# Altium project as14120.PrjPCB (part 2 of 2)

## Sheet as14120_fpga_power_conf.SchDoc
size A3
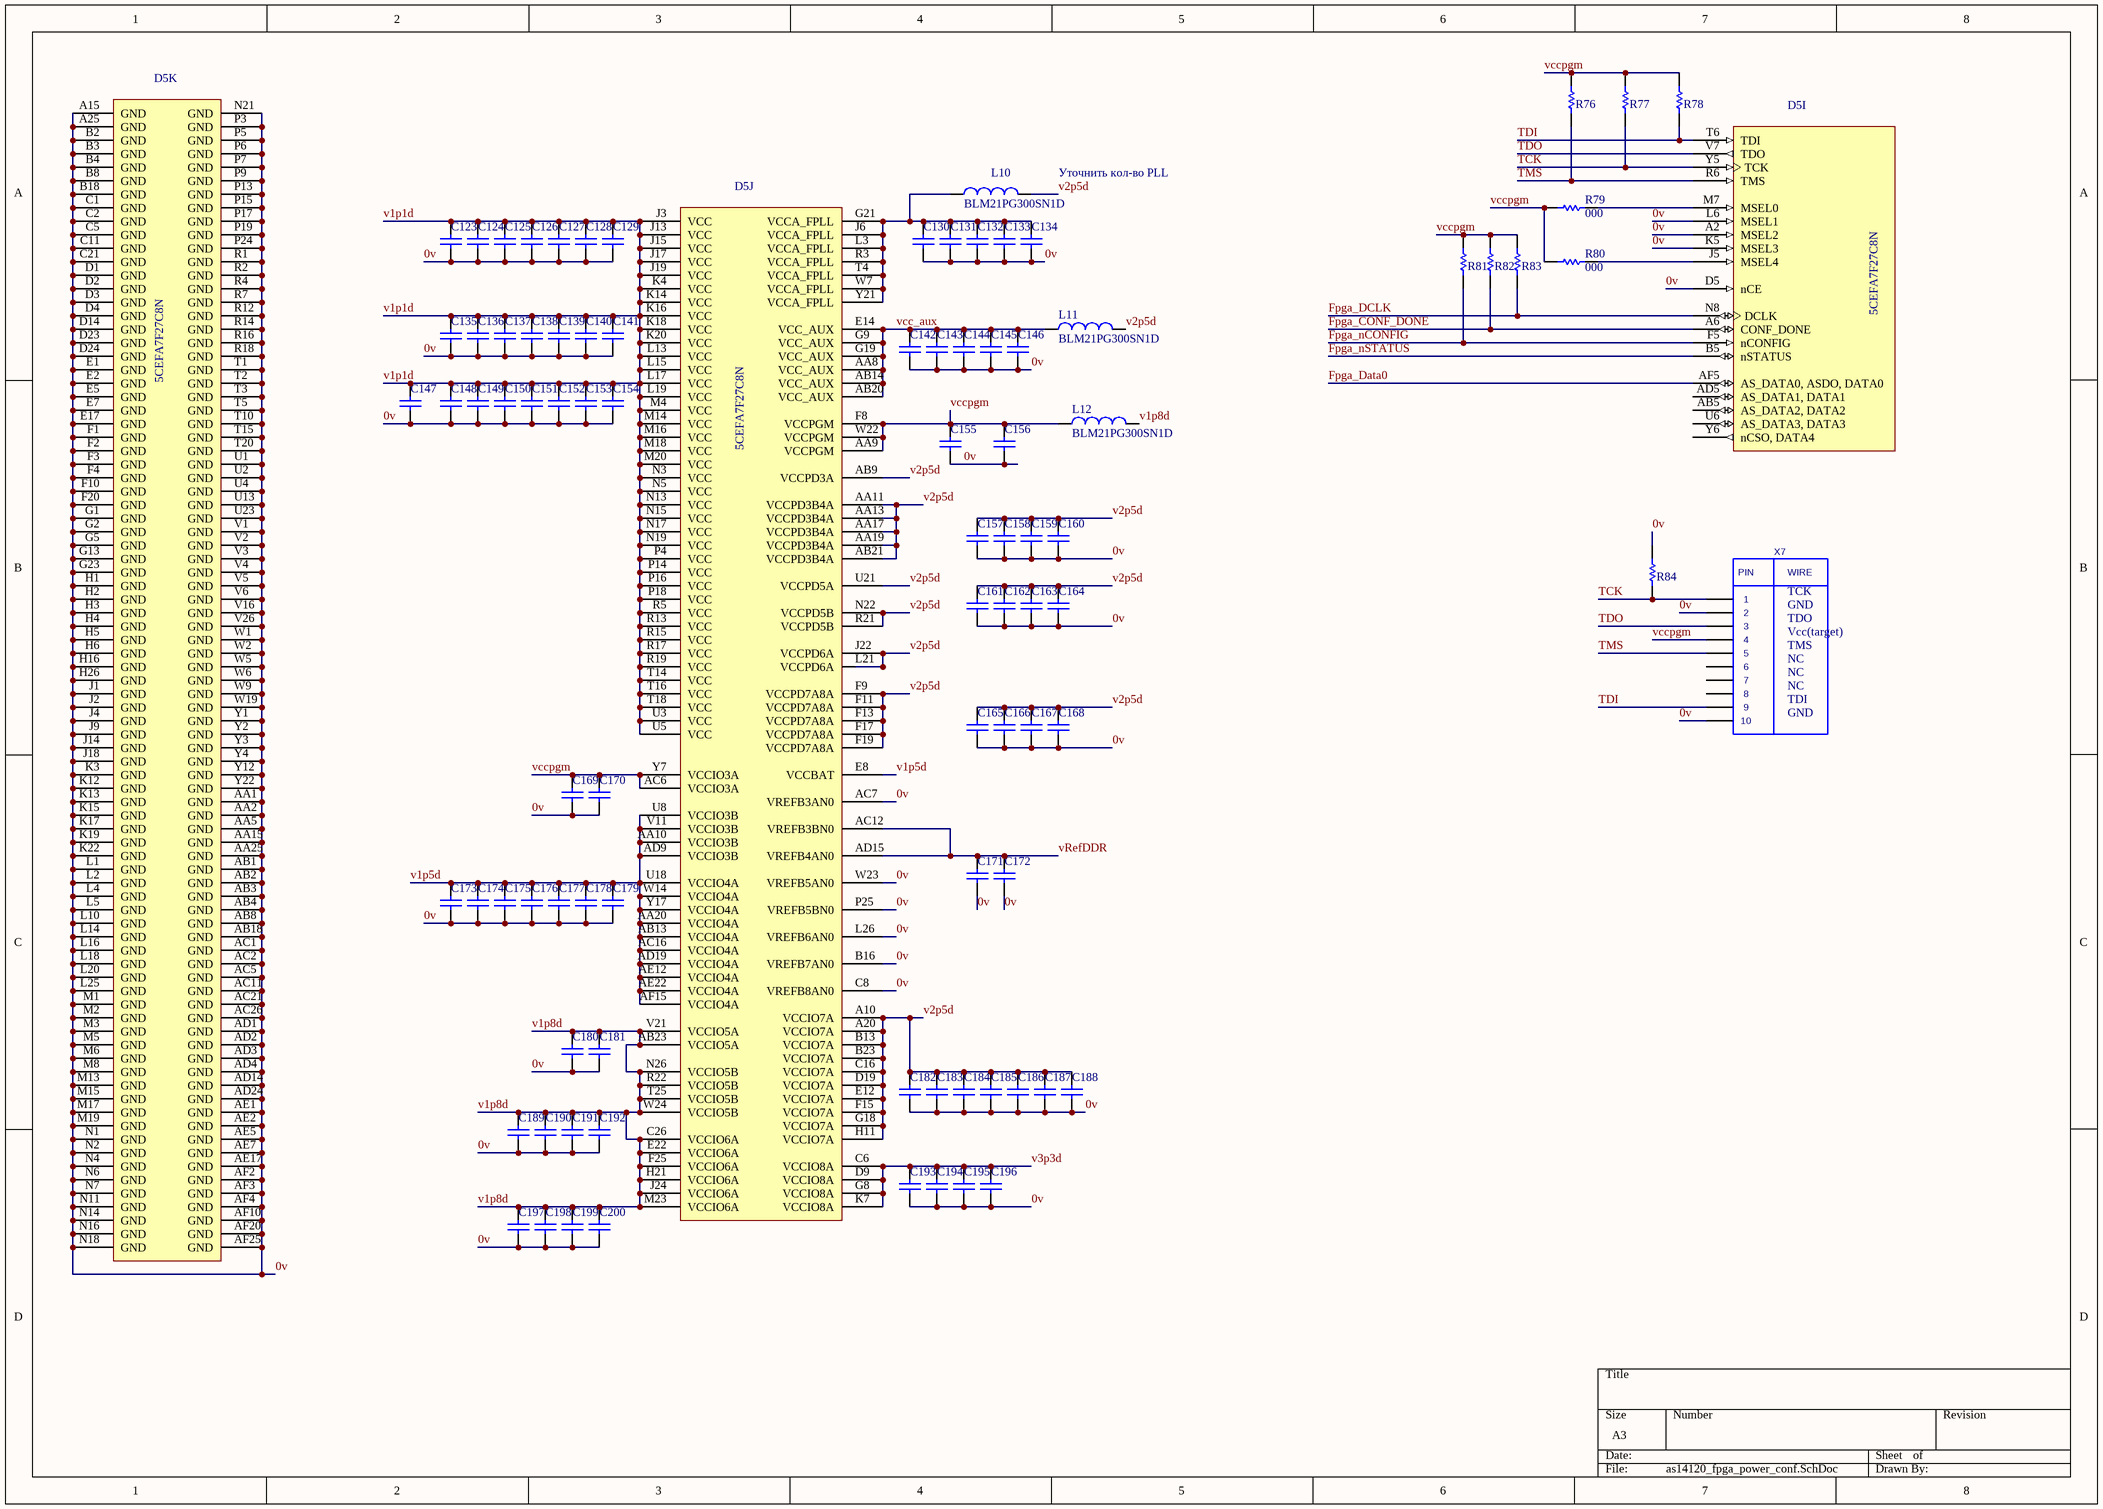
[diagram p4: as14120_fpga_power_conf.SchDoc]

### Parts
C123  CAP 1uF 10V 0402(1005)  [CAPC0402(1005)60_M]  (value not drawn)
C124  CAP 1uF 10V 0402(1005)  [CAPC0402(1005)60_M]  (value not drawn)
C125  CAP 1uF 10V 0402(1005)  [CAPC0402(1005)60_M]  (value not drawn)
C126  CAP 1uF 10V 0402(1005)  [CAPC0402(1005)60_M]  (value not drawn)
C127  CAP 1uF 10V 0402(1005)  [CAPC0402(1005)60_M]  (value not drawn)
C128  CAP 1uF 10V 0402(1005)  [CAPC0402(1005)60_M]  (value not drawn)
C129  CAP 1uF 10V 0402(1005)  [CAPC0402(1005)60_M]  (value not drawn)
C130  CAP 1uF 10V 0402(1005)  [CAPC0402(1005)60_M]  (value not drawn)
C131  CAP 1uF 10V 0402(1005)  [CAPC0402(1005)60_M]  (value not drawn)
C132  CAP 1uF 10V 0402(1005)  [CAPC0402(1005)60_M]  (value not drawn)
C133  CAP 1uF 10V 0402(1005)  [CAPC0402(1005)60_M]  (value not drawn)
C134  CAP 1uF 10V 0402(1005)  [CAPC0402(1005)60_M]  (value not drawn)
C135  CAP 1uF 10V 0402(1005)  [CAPC0402(1005)60_M]  (value not drawn)
C136  CAP 1uF 10V 0402(1005)  [CAPC0402(1005)60_M]  (value not drawn)
C137  CAP 1uF 10V 0402(1005)  [CAPC0402(1005)60_M]  (value not drawn)
C138  CAP 1uF 10V 0402(1005)  [CAPC0402(1005)60_M]  (value not drawn)
C139  CAP 1uF 10V 0402(1005)  [CAPC0402(1005)60_M]  (value not drawn)
C140  CAP 1uF 10V 0402(1005)  [CAPC0402(1005)60_M]  (value not drawn)
C141  CAP 1uF 10V 0402(1005)  [CAPC0402(1005)60_M]  (value not drawn)
C142  CAP 1uF 10V 0402(1005)  [CAPC0402(1005)60_M]  (value not drawn)
C143  CAP 1uF 10V 0402(1005)  [CAPC0402(1005)60_M]  (value not drawn)
C144  CAP 1uF 10V 0402(1005)  [CAPC0402(1005)60_M]  (value not drawn)
C145  CAP 1uF 10V 0402(1005)  [CAPC0402(1005)60_M]  (value not drawn)
C146  CAP 1uF 10V 0402(1005)  [CAPC0402(1005)60_M]  (value not drawn)
C147  CAP 1uF 10V 0402(1005)  [CAPC0402(1005)60_M]  (value not drawn)
C148  CAP 1uF 10V 0402(1005)  [CAPC0402(1005)60_M]  (value not drawn)
C149  CAP 1uF 10V 0402(1005)  [CAPC0402(1005)60_M]  (value not drawn)
C150  CAP 1uF 10V 0402(1005)  [CAPC0402(1005)60_M]  (value not drawn)
C151  CAP 1uF 10V 0402(1005)  [CAPC0402(1005)60_M]  (value not drawn)
C152  CAP 1uF 10V 0402(1005)  [CAPC0402(1005)60_M]  (value not drawn)
C153  CAP 1uF 10V 0402(1005)  [CAPC0402(1005)60_M]  (value not drawn)
C154  CAP 1uF 10V 0402(1005)  [CAPC0402(1005)60_M]  (value not drawn)
C155  CAP 1uF 10V 0402(1005)  [CAPC0402(1005)60_M]  (value not drawn)
C156  CAP 1uF 10V 0402(1005)  [CAPC0402(1005)60_M]  (value not drawn)
C157  CAP 1uF 10V 0402(1005)  [CAPC0402(1005)60_M]  (value not drawn)
C158  CAP 1uF 10V 0402(1005)  [CAPC0402(1005)60_M]  (value not drawn)
C159  CAP 1uF 10V 0402(1005)  [CAPC0402(1005)60_M]  (value not drawn)
C160  CAP 1uF 10V 0402(1005)  [CAPC0402(1005)60_M]  (value not drawn)
C161  CAP 1uF 10V 0402(1005)  [CAPC0402(1005)60_M]  (value not drawn)
C162  CAP 1uF 10V 0402(1005)  [CAPC0402(1005)60_M]  (value not drawn)
C163  CAP 1uF 10V 0402(1005)  [CAPC0402(1005)60_M]  (value not drawn)
C164  CAP 1uF 10V 0402(1005)  [CAPC0402(1005)60_M]  (value not drawn)
C165  CAP 1uF 10V 0402(1005)  [CAPC0402(1005)60_M]  (value not drawn)
C166  CAP 1uF 10V 0402(1005)  [CAPC0402(1005)60_M]  (value not drawn)
C167  CAP 1uF 10V 0402(1005)  [CAPC0402(1005)60_M]  (value not drawn)
C168  CAP 1uF 10V 0402(1005)  [CAPC0402(1005)60_M]  (value not drawn)
C169  CAP 1uF 10V 0402(1005)  [CAPC0402(1005)60_M]  (value not drawn)
C170  CAP 1uF 10V 0402(1005)  [CAPC0402(1005)60_M]  (value not drawn)
C171  CAP 1uF 10V 0402(1005)  [CAPC0402(1005)60_M]  (value not drawn)
C172  CAP 1uF 10V 0402(1005)  [CAPC0402(1005)60_M]  (value not drawn)
C173  CAP 1uF 10V 0402(1005)  [CAPC0402(1005)60_M]  (value not drawn)
C174  CAP 1uF 10V 0402(1005)  [CAPC0402(1005)60_M]  (value not drawn)
C175  CAP 1uF 10V 0402(1005)  [CAPC0402(1005)60_M]  (value not drawn)
C176  CAP 1uF 10V 0402(1005)  [CAPC0402(1005)60_M]  (value not drawn)
C177  CAP 1uF 10V 0402(1005)  [CAPC0402(1005)60_M]  (value not drawn)
C178  CAP 1uF 10V 0402(1005)  [CAPC0402(1005)60_M]  (value not drawn)
C179  CAP 1uF 10V 0402(1005)  [CAPC0402(1005)60_M]  (value not drawn)
C180  CAP 1uF 10V 0402(1005)  [CAPC0402(1005)60_M]  (value not drawn)
C181  CAP 1uF 10V 0402(1005)  [CAPC0402(1005)60_M]  (value not drawn)
C182  CAP 1uF 10V 0402(1005)  [CAPC0402(1005)60_M]  (value not drawn)
C183  CAP 1uF 10V 0402(1005)  [CAPC0402(1005)60_M]  (value not drawn)
C184  CAP 1uF 10V 0402(1005)  [CAPC0402(1005)60_M]  (value not drawn)
C185  CAP 1uF 10V 0402(1005)  [CAPC0402(1005)60_M]  (value not drawn)
C186  CAP 1uF 10V 0402(1005)  [CAPC0402(1005)60_M]  (value not drawn)
C187  CAP 1uF 10V 0402(1005)  [CAPC0402(1005)60_M]  (value not drawn)
C188  CAP 1uF 10V 0402(1005)  [CAPC0402(1005)60_M]  (value not drawn)
C189  CAP 1uF 10V 0402(1005)  [CAPC0402(1005)60_M]  (value not drawn)
C190  CAP 1uF 10V 0402(1005)  [CAPC0402(1005)60_M]  (value not drawn)
C191  CAP 1uF 10V 0402(1005)  [CAPC0402(1005)60_M]  (value not drawn)
C192  CAP 1uF 10V 0402(1005)  [CAPC0402(1005)60_M]  (value not drawn)
C193  CAP 1uF 10V 0402(1005)  [CAPC0402(1005)60_M]  (value not drawn)
C194  CAP 1uF 10V 0402(1005)  [CAPC0402(1005)60_M]  (value not drawn)
C195  CAP 1uF 10V 0402(1005)  [CAPC0402(1005)60_M]  (value not drawn)
C196  CAP 1uF 10V 0402(1005)  [CAPC0402(1005)60_M]  (value not drawn)
C197  CAP 1uF 10V 0402(1005)  [CAPC0402(1005)60_M]  (value not drawn)
C198  CAP 1uF 10V 0402(1005)  [CAPC0402(1005)60_M]  (value not drawn)
C199  CAP 1uF 10V 0402(1005)  [CAPC0402(1005)60_M]  (value not drawn)
C200  CAP 1uF 10V 0402(1005)  [CAPC0402(1005)60_M]  (value not drawn)
D5  5CEFA7F27C8N  [ALTR-672-FBGA-2000A]  (parts I,J,K of 12)
L10  BLM21PG300SN1D  [CAPC0805(2012)100_N]
L11  BLM21PG300SN1D  [CAPC0805(2012)100_N]
L12  BLM21PG300SN1D  [CAPC0805(2012)100_N]
R76  1K 5% 0603(1608)  [RESC0603(1608)_L]  (value not drawn)
R77  1K 5% 0603(1608)  [RESC0603(1608)_L]  (value not drawn)
R78  1K 5% 0603(1608)  [RESC0603(1608)_L]  (value not drawn)
R79  value 000  [RESC0603(1608)_L]  (hidden comment: 1K 5% 0603(1608))
R80  value 000  [RESC0603(1608)_L]  (hidden comment: 1K 5% 0603(1608))
R81  1K 5% 0603(1608)  [RESC0603(1608)_L]  (value not drawn)
R82  1K 5% 0603(1608)  [RESC0603(1608)_L]  (value not drawn)
R83  1K 5% 0603(1608)  [RESC0603(1608)_L]  (value not drawn)
R84  1K 5% 0603(1608)  [RESC0603(1608)_L]  (value not drawn)
X7  IDC10  [IDC10M]  (value not drawn)

### Nets
0v: C123.1 C124.1 C125.1 C126.1 C127.1 C128.1 C129.1 C130.1 C131.1 C132.1 C133.1 C134.1 C135.1 C136.1 C137.1 C138.1 C139.1 C140.1 C141.1 C142.1 C143.1 C144.1 C145.1 C146.1 C147.1 C148.1 C149.1 C150.1 C151.1 C152.1 C153.1 C154.1 C155.1 C156.1 C157.1 C158.1 C159.1 C160.1 C161.1 C162.1 C163.1 C164.1 C165.1 C166.1 C167.1 C168.1 C169.1 C170.1 C171.1 C172.1 C173.1 C174.1 C175.1 C176.1 C177.1 C178.1 C179.1 C180.1 C181.1 C182.1 C183.1 C184.1 C185.1 C186.1 C187.1 C188.1 C189.1 C190.1 C191.1 C192.1 C193.1 C194.1 C195.1 C196.1 C197.1 C198.1 C199.1 C200.1 D5.A2(MSEL2) D5.A15(GND) D5.A25(GND) D5.AA1(GND) D5.AA2(GND) D5.AA5(GND) D5.AA15(GND) D5.AA25(GND) D5.AB1(GND) D5.AB2(GND) D5.AB3(GND) D5.AB4(GND) D5.AB8(GND) D5.AB18(GND) D5.AC1(GND) D5.AC2(GND) D5.AC5(GND) D5.AC7(VREFB3AN0) D5.AC11(GND) D5.AC21(GND) D5.AC26(GND) D5.AD1(GND) D5.AD2(GND) D5.AD3(GND) D5.AD4(GND) D5.AD14(GND) D5.AD24(GND) D5.AE1(GND) D5.AE2(GND) D5.AE5(GND) D5.AE7(GND) D5.AE17(GND) D5.AF2(GND) D5.AF3(GND) D5.AF4(GND) D5.AF10(GND) D5.AF20(GND) D5.AF25(GND) D5.B2(GND) D5.B3(GND) D5.B4(GND) D5.B8(GND) D5.B16(VREFB7AN0) D5.B18(GND) D5.C1(GND) D5.C2(GND) D5.C5(GND) D5.C8(VREFB8AN0) D5.C11(GND) D5.C21(GND) D5.D1(GND) D5.D2(GND) D5.D3(GND) D5.D4(GND) D5.D5(nCE) D5.D14(GND) D5.D23(GND) D5.D24(GND) D5.E1(GND) D5.E2(GND) D5.E5(GND) D5.E7(GND) D5.E17(GND) D5.F1(GND) D5.F2(GND) D5.F3(GND) D5.F4(GND) D5.F10(GND) D5.F20(GND) D5.G1(GND) D5.G2(GND) D5.G5(GND) D5.G13(GND) D5.G23(GND) D5.H1(GND) D5.H2(GND) D5.H3(GND) D5.H4(GND) D5.H5(GND) D5.H6(GND) D5.H16(GND) D5.H26(GND) D5.J1(GND) D5.J2(GND) D5.J4(GND) D5.J9(GND) D5.J14(GND) D5.J18(GND) D5.K3(GND) D5.K5(MSEL3) D5.K12(GND) D5.K13(GND) D5.K15(GND) D5.K17(GND) D5.K19(GND) D5.K22(GND) D5.L1(GND) D5.L2(GND) D5.L4(GND) D5.L5(GND) D5.L6(MSEL1) D5.L10(GND) D5.L14(GND) D5.L16(GND) D5.L18(GND) D5.L20(GND) D5.L25(GND) D5.L26(VREFB6AN0) D5.M1(GND) D5.M2(GND) D5.M3(GND) D5.M5(GND) D5.M6(GND) D5.M8(GND) D5.M13(GND) D5.M15(GND) D5.M17(GND) D5.M19(GND) D5.N1(GND) D5.N2(GND) D5.N4(GND) D5.N6(GND) D5.N7(GND) D5.N11(GND) D5.N14(GND) D5.N16(GND) D5.N18(GND) D5.N21(GND) D5.P3(GND) D5.P5(GND) D5.P6(GND) D5.P7(GND) D5.P9(GND) D5.P13(GND) D5.P15(GND) D5.P17(GND) D5.P19(GND) D5.P24(GND) D5.P25(VREFB5BN0) D5.R1(GND) D5.R2(GND) D5.R4(GND) D5.R7(GND) D5.R12(GND) D5.R14(GND) D5.R16(GND) D5.R18(GND) D5.T1(GND) D5.T2(GND) D5.T3(GND) D5.T5(GND) D5.T10(GND) D5.T15(GND) D5.T20(GND) D5.U1(GND) D5.U2(GND) D5.U4(GND) D5.U13(GND) D5.U23(GND) D5.V1(GND) D5.V2(GND) D5.V3(GND) D5.V4(GND) D5.V5(GND) D5.V6(GND) D5.V16(GND) D5.V26(GND) D5.W1(GND) D5.W2(GND) D5.W5(GND) D5.W6(GND) D5.W9(GND) D5.W19(GND) D5.W23(VREFB5AN0) D5.Y1(GND) D5.Y2(GND) D5.Y3(GND) D5.Y4(GND) D5.Y12(GND) D5.Y22(GND) R84.1 X7.2 X7.10
Fpga_CONF_DONE: D5.A6(CONF_DONE) R82.2
Fpga_Data0: D5.AF5(AS_DATA0,_ASDO,_DATA0)
Fpga_DCLK: D5.N8(DCLK) R83.2
Fpga_nCONFIG: D5.F5(nCONFIG) R81.2
Fpga_nSTATUS: D5.B5(nSTATUS)
TCK: D5.Y5(TCK) R77.2 R84.2 X7.1
TDI: D5.T6(TDI) R78.1 X7.9
TDO: D5.V7(TDO) X7.3
TMS: D5.R6(TMS) R76.2 X7.5
v1p1d: C123.2 C124.2 C125.2 C126.2 C127.2 C128.2 C129.2 C135.2 C136.2 C137.2 C138.2 C139.2 C140.2 C141.2 C147.2 C148.2 C149.2 C150.2 C151.2 C152.2 C153.2 C154.2 D5.J3(VCC) D5.J13(VCC) D5.J15(VCC) D5.J17(VCC) D5.J19(VCC) D5.K4(VCC) D5.K14(VCC) D5.K16(VCC) D5.K18(VCC) D5.K20(VCC) D5.L13(VCC) D5.L15(VCC) D5.L17(VCC) D5.L19(VCC) D5.M4(VCC) D5.M14(VCC) D5.M16(VCC) D5.M18(VCC) D5.M20(VCC) D5.N3(VCC) D5.N5(VCC) D5.N13(VCC) D5.N15(VCC) D5.N17(VCC) D5.N19(VCC) D5.P4(VCC) D5.P14(VCC) D5.P16(VCC) D5.P18(VCC) D5.R5(VCC) D5.R13(VCC) D5.R15(VCC) D5.R17(VCC) D5.R19(VCC) D5.T14(VCC) D5.T16(VCC) D5.T18(VCC) D5.U3(VCC) D5.U5(VCC)
v1p5d: C173.2 C174.2 C175.2 C176.2 C177.2 C178.2 C179.2 D5.AA10(VCCIO3B) D5.AA20(VCCIO4A) D5.AB13(VCCIO4A) D5.AC16(VCCIO4A) D5.AD9(VCCIO3B) D5.AD19(VCCIO4A) D5.AE12(VCCIO4A) D5.AE22(VCCIO4A) D5.AF15(VCCIO4A) D5.E8(VCCBAT) D5.U8(VCCIO3B) D5.U18(VCCIO4A) D5.V11(VCCIO3B) D5.W14(VCCIO4A) D5.Y17(VCCIO4A)
v1p8d: C180.2 C181.2 C189.2 C190.2 C191.2 C192.2 C197.2 C198.2 C199.2 C200.2 D5.AB23(VCCIO5A) D5.C26(VCCIO6A) D5.E22(VCCIO6A) D5.F25(VCCIO6A) D5.H21(VCCIO6A) D5.J24(VCCIO6A) D5.M23(VCCIO6A) D5.N26(VCCIO5B) D5.R22(VCCIO5B) D5.T25(VCCIO5B) D5.V21(VCCIO5A) D5.W24(VCCIO5B) L12.2
v2p5d: C157.2 C158.2 C159.2 C160.2 C161.2 C162.2 C163.2 C164.2 C165.2 C166.2 C167.2 C168.2 C182.2 C183.2 C184.2 C185.2 C186.2 C187.2 C188.2 D5.A10(VCCIO7A) D5.A20(VCCIO7A) D5.AA11(VCCPD3B4A) D5.AA13(VCCPD3B4A) D5.AA17(VCCPD3B4A) D5.AA19(VCCPD3B4A) D5.AB9(VCCPD3A) D5.AB21(VCCPD3B4A) D5.B13(VCCIO7A) D5.B23(VCCIO7A) D5.C16(VCCIO7A) D5.D19(VCCIO7A) D5.E12(VCCIO7A) D5.F9(VCCPD7A8A) D5.F11(VCCPD7A8A) D5.F13(VCCPD7A8A) D5.F15(VCCIO7A) D5.F17(VCCPD7A8A) D5.F19(VCCPD7A8A) D5.G18(VCCIO7A) D5.H11(VCCIO7A) D5.J22(VCCPD6A) D5.L21(VCCPD6A) D5.N22(VCCPD5B) D5.R21(VCCPD5B) D5.U21(VCCPD5A) L10.2 L11.2
v3p3d: C193.2 C194.2 C195.2 C196.2 D5.C6(VCCIO8A) D5.D9(VCCIO8A) D5.G8(VCCIO8A) D5.K7(VCCIO8A)
vcc_aux: C142.2 C143.2 C144.2 C145.2 C146.2 D5.AA8(VCC_AUX) D5.AB14(VCC_AUX) D5.AB20(VCC_AUX) D5.E14(VCC_AUX) D5.G9(VCC_AUX) D5.G19(VCC_AUX) L11.1
vccpgm: C155.2 C156.2 C169.2 C170.2 D5.AA9(VCCPGM) D5.AC6(VCCIO3A) D5.F8(VCCPGM) D5.W22(VCCPGM) D5.Y7(VCCIO3A) L12.1 R76.1 R77.1 R78.2 R79.2 R80.2 R81.1 R82.1 R83.1 X7.4
vRefDDR: C171.2 C172.2 D5.AC12(VREFB3BN0) D5.AD15(VREFB4AN0)
NetC130_2: C130.2 C131.2 C132.2 C133.2 C134.2 D5.G21(VCCA_FPLL) D5.J6(VCCA_FPLL) D5.L3(VCCA_FPLL) D5.R3(VCCA_FPLL) D5.T4(VCCA_FPLL) D5.W7(VCCA_FPLL) D5.Y21(VCCA_FPLL) L10.1
NetD5_J5: D5.J5(MSEL4) R80.1
NetD5_M7: D5.M7(MSEL0) R79.1

Not connected (* = marked no-connect by the designer): D5 AB5(AS_DATA2,_DATA2) AD5(AS_DATA1,_DATA1) U6(AS_DATA3,_DATA3) Y6(nCSO,_DATA4); X7 6 7 8

### Notes on the sheet
- Уточнить кол-во PLL
- TCK
- GND
- TDO
- Vcc(target)
- TMS
- NC
- TDI
- (in symbol IDC10) PIN; WIRE

### Library data of the parts
C123-C200 = CAP_0402: CAP 1uF 10V ±20% 0402 (1005 Metric) Thickness 0.6mm SMD; Case-Metric: 1005; Case-EIA: 0402; Value: 0.1; Tolerance: ±20%; Max Thickness: 0.6 mm; Rated Voltage: 10 V; Technology: SMT
D5 = 5CEFA7F27C8N: as D5 on sheet as14120_fpga_ttl; DatasheetVersion: Rev. 3.1; PackageReference: 672-FBGA-2000A; PackageDescription: 672-Pin FineLine Ball-Grid Array (FBGA), Body 27 x 27 mm, Pitch 1 mm; Supplier 1: Digi-Key; Supplier Part Number 1: 5CEFA7F27C8N-ND; Supplier 2: Mouser; Supplier Part Number 2: 989-5CEFA7F27C8N; RoHS: RoHS Compliant; Subcategory: Cyclone V E; Voltage Supply: 1.07 to 1.13 V; Mounting Technology: Surface Mount; Code_JEDEC: MS-034-AAL-1; PartNumber: 5CEFA7F27C8N; ComponentLink1Description: Manufacturer URL; ComponentLink1URL: http://www.altera.com; ComponentLink2Description: Datasheet; ComponentLink2URL: http://www.altera.com/literature/hb/cyclone-v/cv_51002.pdf; ComponentLink3Description: Package Specification; ComponentLink3URL: http://www.altera.com/devicepackaging/04R00427-01.pdf; ComponentLink4Description: Device Handbook URL; ComponentLink4URL: http://www.altera.com/literature/hb/cyclone-v/cyclone5_handbook.pdf; ComponentLink5Description: Device Overview URL; ComponentLink5URL: http://www.altera.com/literature/hb/cyclone-v/cv_51001.pdf; ComponentLink6Description: Device Pin-Out URL; ComponentLink6URL: http://www.altera.com/literature/dp/cyclone-v/1.1.txt; ComponentLink7Description: Product URL; ComponentLink7URL: http://www.buyaltera.com/scripts/partsearch.dll?Detail&name=5CEFA7F27C8N-ND
L10-L12 = Ferrite_beat
R76-R78 R81-R83 = RES_0603: 1K 0.1W 5% 0603 (1608 Metric)  SMD; Case-EIA: 0603; Case-Metric: 1608; Value: 10k; Technology: SMT; Tolerance: 5 %; Power: 0.1 W
R79 R80 R84 = RES_0603: as R3 on sheet as14120_usb; Technology: SMT; Tolerance: 5 %; Power: 0.1 W
  R84: Value: 1k
X7 = IDC10: Value: *

## Sheet as14120_fpga_cypress.SchDoc
size A3
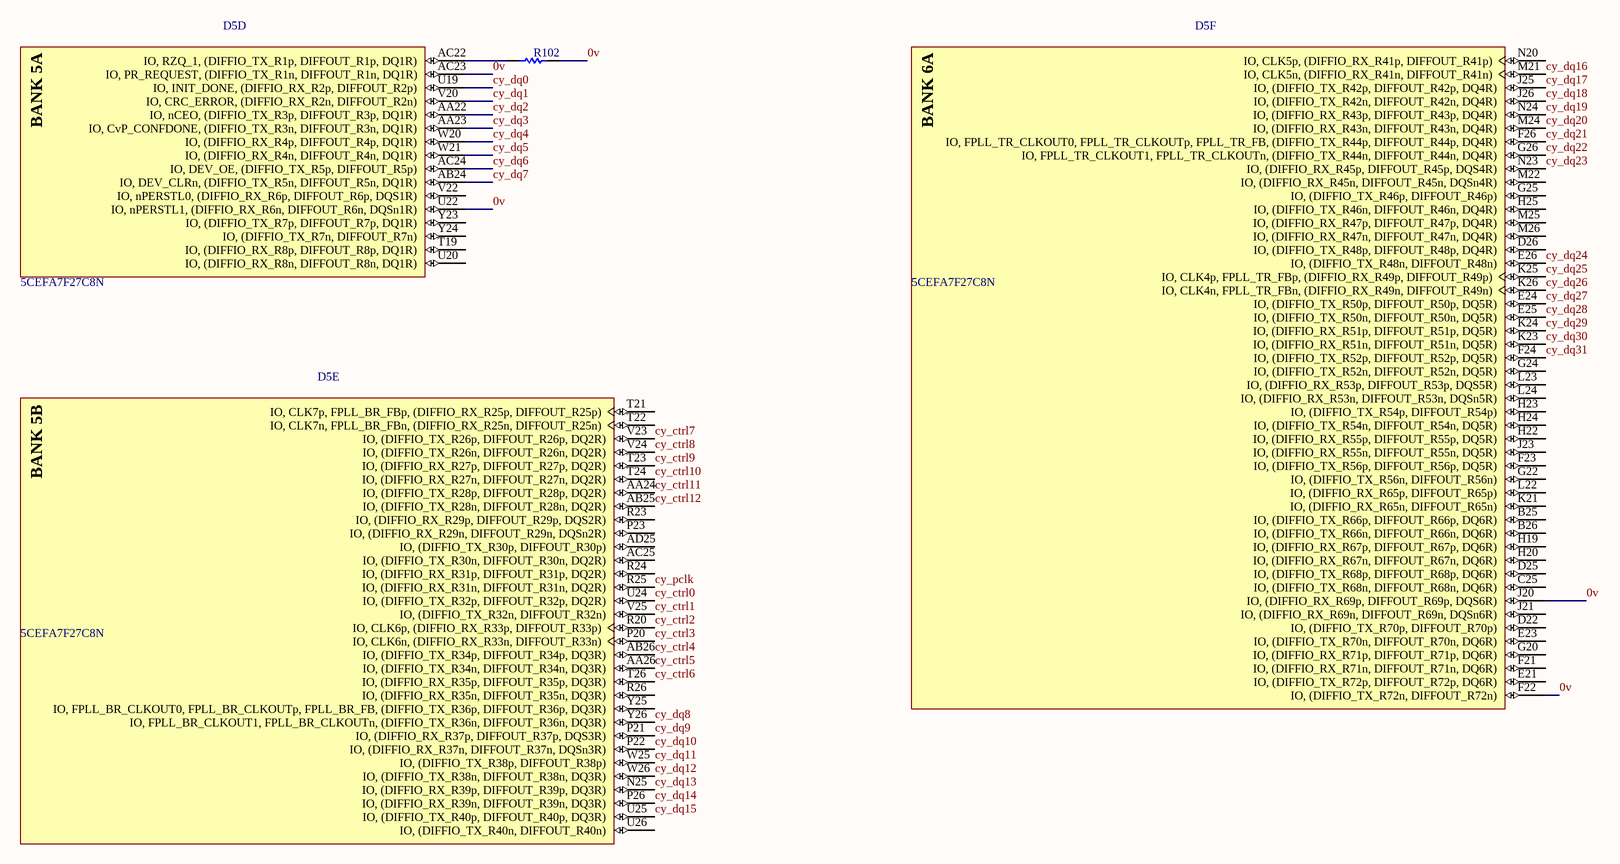
[diagram p5: as14120_fpga_cypress.SchDoc]

### Parts
D5  5CEFA7F27C8N  [ALTR-672-FBGA-2000A]  (parts D,E,F of 12)
R102  ???  [RESC0603(1608)_L]  (value not drawn)

### Nets
0v: D5.AC23(IO,_PR_REQUEST,_(DIFFIO_TX_R1n,_DIFFOUT_R1n,_DQ1R)) D5.F22(IO,_(DIFFIO_TX_R72n,_DIFFOUT_R72n)) D5.J20(IO,_(DIFFIO_RX_R69p,_DIFFOUT_R69p,_DQS6R)) D5.U22(IO,_nPERSTL1,_(DIFFIO_RX_R6n,_DIFFOUT_R6n,_DQSn1R)) R102.2
cy_ctrl0: D5.U24(IO,_(DIFFIO_TX_R32p,_DIFFOUT_R32p,_DQ2R))
cy_ctrl1: D5.V25(IO,_(DIFFIO_TX_R32n,_DIFFOUT_R32n))
cy_ctrl2: D5.R20(IO,_CLK6p,_(DIFFIO_RX_R33p,_DIFFOUT_R33p))
cy_ctrl3: D5.P20(IO,_CLK6n,_(DIFFIO_RX_R33n,_DIFFOUT_R33n))
cy_ctrl4: D5.AB26(IO,_(DIFFIO_TX_R34p,_DIFFOUT_R34p,_DQ3R))
cy_ctrl5: D5.AA26(IO,_(DIFFIO_TX_R34n,_DIFFOUT_R34n,_DQ3R))
cy_ctrl6: D5.T26(IO,_(DIFFIO_RX_R35p,_DIFFOUT_R35p,_DQ3R))
cy_ctrl7: D5.V23(IO,_(DIFFIO_TX_R26p,_DIFFOUT_R26p,_DQ2R))
cy_ctrl8: D5.V24(IO,_(DIFFIO_TX_R26n,_DIFFOUT_R26n,_DQ2R))
cy_ctrl9: D5.T23(IO,_(DIFFIO_RX_R27p,_DIFFOUT_R27p,_DQ2R))
cy_ctrl10: D5.T24(IO,_(DIFFIO_RX_R27n,_DIFFOUT_R27n,_DQ2R))
cy_ctrl11: D5.AA24(IO,_(DIFFIO_TX_R28p,_DIFFOUT_R28p,_DQ2R))
cy_ctrl12: D5.AB25(IO,_(DIFFIO_TX_R28n,_DIFFOUT_R28n,_DQ2R))
cy_dq0: D5.U19(IO,_INIT_DONE,_(DIFFIO_RX_R2p,_DIFFOUT_R2p))
cy_dq1: D5.V20(IO,_CRC_ERROR,_(DIFFIO_RX_R2n,_DIFFOUT_R2n))
cy_dq2: D5.AA22(IO,_nCEO,_(DIFFIO_TX_R3p,_DIFFOUT_R3p,_DQ1R))
cy_dq3: D5.AA23(IO,_CvP_CONFDONE,_(DIFFIO_TX_R3n,_DIFFOUT_R3n,_DQ1R))
cy_dq4: D5.W20(IO,_(DIFFIO_RX_R4p,_DIFFOUT_R4p,_DQ1R))
cy_dq5: D5.W21(IO,_(DIFFIO_RX_R4n,_DIFFOUT_R4n,_DQ1R))
cy_dq6: D5.AC24(IO,_DEV_OE,_(DIFFIO_TX_R5p,_DIFFOUT_R5p))
cy_dq7: D5.AB24(IO,_DEV_CLRn,_(DIFFIO_TX_R5n,_DIFFOUT_R5n,_DQ1R))
cy_dq8: D5.Y26(IO,_FPLL_BR_CLKOUT1,_FPLL_BR_CLKOUTn,_(DIFFIO_TX_R36n,_DIFFOUT_R36n,_DQ3R))
cy_dq9: D5.P21(IO,_(DIFFIO_RX_R37p,_DIFFOUT_R37p,_DQS3R))
cy_dq10: D5.P22(IO,_(DIFFIO_RX_R37n,_DIFFOUT_R37n,_DQSn3R))
cy_dq11: D5.W25(IO,_(DIFFIO_TX_R38p,_DIFFOUT_R38p))
cy_dq12: D5.W26(IO,_(DIFFIO_TX_R38n,_DIFFOUT_R38n,_DQ3R))
cy_dq13: D5.N25(IO,_(DIFFIO_RX_R39p,_DIFFOUT_R39p,_DQ3R))
cy_dq14: D5.P26(IO,_(DIFFIO_RX_R39n,_DIFFOUT_R39n,_DQ3R))
cy_dq15: D5.U25(IO,_(DIFFIO_TX_R40p,_DIFFOUT_R40p,_DQ3R))
cy_dq16: D5.M21(IO,_CLK5n,_(DIFFIO_RX_R41n,_DIFFOUT_R41n))
cy_dq17: D5.J25(IO,_(DIFFIO_TX_R42p,_DIFFOUT_R42p,_DQ4R))
cy_dq18: D5.J26(IO,_(DIFFIO_TX_R42n,_DIFFOUT_R42n,_DQ4R))
cy_dq19: D5.N24(IO,_(DIFFIO_RX_R43p,_DIFFOUT_R43p,_DQ4R))
cy_dq20: D5.M24(IO,_(DIFFIO_RX_R43n,_DIFFOUT_R43n,_DQ4R))
cy_dq21: D5.F26(IO,_FPLL_TR_CLKOUT0,_FPLL_TR_CLKOUTp,_FPLL_TR_FB,_(DIFFIO_TX_R44p,_DIFFOUT_R44p,_DQ4R))
cy_dq22: D5.G26(IO,_FPLL_TR_CLKOUT1,_FPLL_TR_CLKOUTn,_(DIFFIO_TX_R44n,_DIFFOUT_R44n,_DQ4R))
cy_dq23: D5.N23(IO,_(DIFFIO_RX_R45p,_DIFFOUT_R45p,_DQS4R))
cy_dq24: D5.E26(IO,_(DIFFIO_TX_R48n,_DIFFOUT_R48n))
cy_dq25: D5.K25(IO,_CLK4p,_FPLL_TR_FBp,_(DIFFIO_RX_R49p,_DIFFOUT_R49p))
cy_dq26: D5.K26(IO,_CLK4n,_FPLL_TR_FBn,_(DIFFIO_RX_R49n,_DIFFOUT_R49n))
cy_dq27: D5.E24(IO,_(DIFFIO_TX_R50p,_DIFFOUT_R50p,_DQ5R))
cy_dq28: D5.E25(IO,_(DIFFIO_TX_R50n,_DIFFOUT_R50n,_DQ5R))
cy_dq29: D5.K24(IO,_(DIFFIO_RX_R51p,_DIFFOUT_R51p,_DQ5R))
cy_dq30: D5.K23(IO,_(DIFFIO_RX_R51n,_DIFFOUT_R51n,_DQ5R))
cy_dq31: D5.F24(IO,_(DIFFIO_TX_R52p,_DIFFOUT_R52p,_DQ5R))
cy_pclk: D5.R25(IO,_(DIFFIO_RX_R31n,_DIFFOUT_R31n,_DQ2R))
NetD5_AC22: D5.AC22(IO,_RZQ_1,_(DIFFIO_TX_R1p,_DIFFOUT_R1p,_DQ1R)) R102.1

Not connected (* = marked no-connect by the designer): D5 AC25(IO,_(DIFFIO_TX_R30n,_DIFFOUT_R30n,_DQ2R)) AD25(IO,_(DIFFIO_TX_R30p,_DIFFOUT_R30p)) B25(IO,_(DIFFIO_TX_R66p,_DIFFOUT_R66p,_DQ6R)) B26(IO,_(DIFFIO_TX_R66n,_DIFFOUT_R66n,_DQ6R)) C25(IO,_(DIFFIO_TX_R68n,_DIFFOUT_R68n,_DQ6R)) D22(IO,_(DIFFIO_TX_R70p,_DIFFOUT_R70p)) D25(IO,_(DIFFIO_TX_R68p,_DIFFOUT_R68p,_DQ6R)) D26(IO,_(DIFFIO_TX_R48p,_DIFFOUT_R48p,_DQ4R)) E21(IO,_(DIFFIO_TX_R72p,_DIFFOUT_R72p,_DQ6R)) E23(IO,_(DIFFIO_TX_R70n,_DIFFOUT_R70n,_DQ6R)) F21(IO,_(DIFFIO_RX_R71n,_DIFFOUT_R71n,_DQ6R)) F23(IO,_(DIFFIO_TX_R56p,_DIFFOUT_R56p,_DQ5R)) G20(IO,_(DIFFIO_RX_R71p,_DIFFOUT_R71p,_DQ6R)) G22(IO,_(DIFFIO_TX_R56n,_DIFFOUT_R56n)) G24(IO,_(DIFFIO_TX_R52n,_DIFFOUT_R52n,_DQ5R)) G25(IO,_(DIFFIO_TX_R46p,_DIFFOUT_R46p)) H19(IO,_(DIFFIO_RX_R67p,_DIFFOUT_R67p,_DQ6R)) H20(IO,_(DIFFIO_RX_R67n,_DIFFOUT_R67n,_DQ6R)) H22(IO,_(DIFFIO_RX_R55p,_DIFFOUT_R55p,_DQ5R)) H23(IO,_(DIFFIO_TX_R54p,_DIFFOUT_R54p)) H24(IO,_(DIFFIO_TX_R54n,_DIFFOUT_R54n,_DQ5R)) H25(IO,_(DIFFIO_TX_R46n,_DIFFOUT_R46n,_DQ4R)) J21(IO,_(DIFFIO_RX_R69n,_DIFFOUT_R69n,_DQSn6R)) J23(IO,_(DIFFIO_RX_R55n,_DIFFOUT_R55n,_DQ5R)) K21(IO,_(DIFFIO_RX_R65n,_DIFFOUT_R65n)) L22(IO,_(DIFFIO_RX_R65p,_DIFFOUT_R65p)) L23(IO,_(DIFFIO_RX_R53p,_DIFFOUT_R53p,_DQS5R)) L24(IO,_(DIFFIO_RX_R53n,_DIFFOUT_R53n,_DQSn5R)) M22(IO,_(DIFFIO_RX_R45n,_DIFFOUT_R45n,_DQSn4R)) M25(IO,_(DIFFIO_RX_R47p,_DIFFOUT_R47p,_DQ4R)) M26(IO,_(DIFFIO_RX_R47n,_DIFFOUT_R47n,_DQ4R)) N20(IO,_CLK5p,_(DIFFIO_RX_R41p,_DIFFOUT_R41p)) P23(IO,_(DIFFIO_RX_R29n,_DIFFOUT_R29n,_DQSn2R)) R23(IO,_(DIFFIO_RX_R29p,_DIFFOUT_R29p,_DQS2R)) R24(IO,_(DIFFIO_RX_R31p,_DIFFOUT_R31p,_DQ2R)) R26(IO,_(DIFFIO_RX_R35n,_DIFFOUT_R35n,_DQ3R)) T19(IO,_(DIFFIO_RX_R8p,_DIFFOUT_R8p,_DQ1R)) T21(IO,_CLK7p,_FPLL_BR_FBp,_(DIFFIO_RX_R25p,_DIFFOUT_R25p)) T22(IO,_CLK7n,_FPLL_BR_FBn,_(DIFFIO_RX_R25n,_DIFFOUT_R25n)) U20(IO,_(DIFFIO_RX_R8n,_DIFFOUT_R8n,_DQ1R)) U26(IO,_(DIFFIO_TX_R40n,_DIFFOUT_R40n)) V22(IO,_nPERSTL0,_(DIFFIO_RX_R6p,_DIFFOUT_R6p,_DQS1R)) Y23(IO,_(DIFFIO_TX_R7p,_DIFFOUT_R7p,_DQ1R)) Y24(IO,_(DIFFIO_TX_R7n,_DIFFOUT_R7n)) Y25(IO,_FPLL_BR_CLKOUT0,_FPLL_BR_CLKOUTp,_FPLL_BR_FB,_(DIFFIO_TX_R36p,_DIFFOUT_R36p,_DQ3R))

### Notes on the sheet
- Title
- Size:
- Date:
- A3
- Number:
- Time:
- Revision:
- Sheet
- of
- File:
- (in symbol 5CEFA7F27C8N, part D) BANK 5A
- (in symbol 5CEFA7F27C8N, part E) BANK 5B
- (in symbol 5CEFA7F27C8N, part F) BANK 6A

### Library data of the parts
D5 = 5CEFA7F27C8N: Cyclone V E Family FPGA, 1.07 to 1.13 V Supply, 336 I/O Pins, 7 PLLs, 672-Pin FBGA, Speed Grade 8, Commercial Grade, RoHS Compliant; Manufacturer: Altera; Device Group: 5CEFA7; GPIO: 336; Logic Elements (LE) (K): 149.5; Speed Grade: 8; DatasheetVersion: Rev. 3.1; PackageReference: 672-FBGA-2000A; PackageDescription: 672-Pin FineLine Ball-Grid Array (FBGA), Body 27 x 27 mm, Pitch 1 mm; Supplier 1: Digi-Key; Supplier Part Number 1: 5CEFA7F27C8N-ND; Supplier 2: Mouser; Supplier Part Number 2: 989-5CEFA7F27C8N; RoHS: RoHS Compliant; Subcategory: Cyclone V E; Voltage Supply: 1.07 to 1.13 V; Mounting Technology: Surface Mount; Code_JEDEC: MS-034-AAL-1; PartNumber: 5CEFA7F27C8N; ComponentLink1Description: Manufacturer URL; ComponentLink1URL: http://www.altera.com; ComponentLink2Description: Datasheet; ComponentLink2URL: http://www.altera.com/literature/hb/cyclone-v/cv_51002.pdf; ComponentLink3Description: Package Specification; ComponentLink3URL: http://www.altera.com/devicepackaging/04R00427-01.pdf; ComponentLink4Description: Device Handbook URL; ComponentLink4URL: http://www.altera.com/literature/hb/cyclone-v/cyclone5_handbook.pdf; ComponentLink5Description: Device Overview URL; ComponentLink5URL: http://www.altera.com/literature/hb/cyclone-v/cv_51001.pdf; ComponentLink6Description: Device Pin-Out URL; ComponentLink6URL: http://www.altera.com/literature/dp/cyclone-v/1.1.txt; ComponentLink7Description: Product URL; ComponentLink7URL: http://www.buyaltera.com/scripts/partsearch.dll?Detail&name=5CEFA7F27C8N-ND
R102 = RES_0603: 1K 0.1W 5% 0603 (1608 Metric)  SMD; Case-EIA: 0603; Case-Metric: 1608; Technology: SMT; Value: ???; Tolerance: 5 %; Power: 0.1 W

## Sheet as14120_fpga_adc.SchDoc
size A3
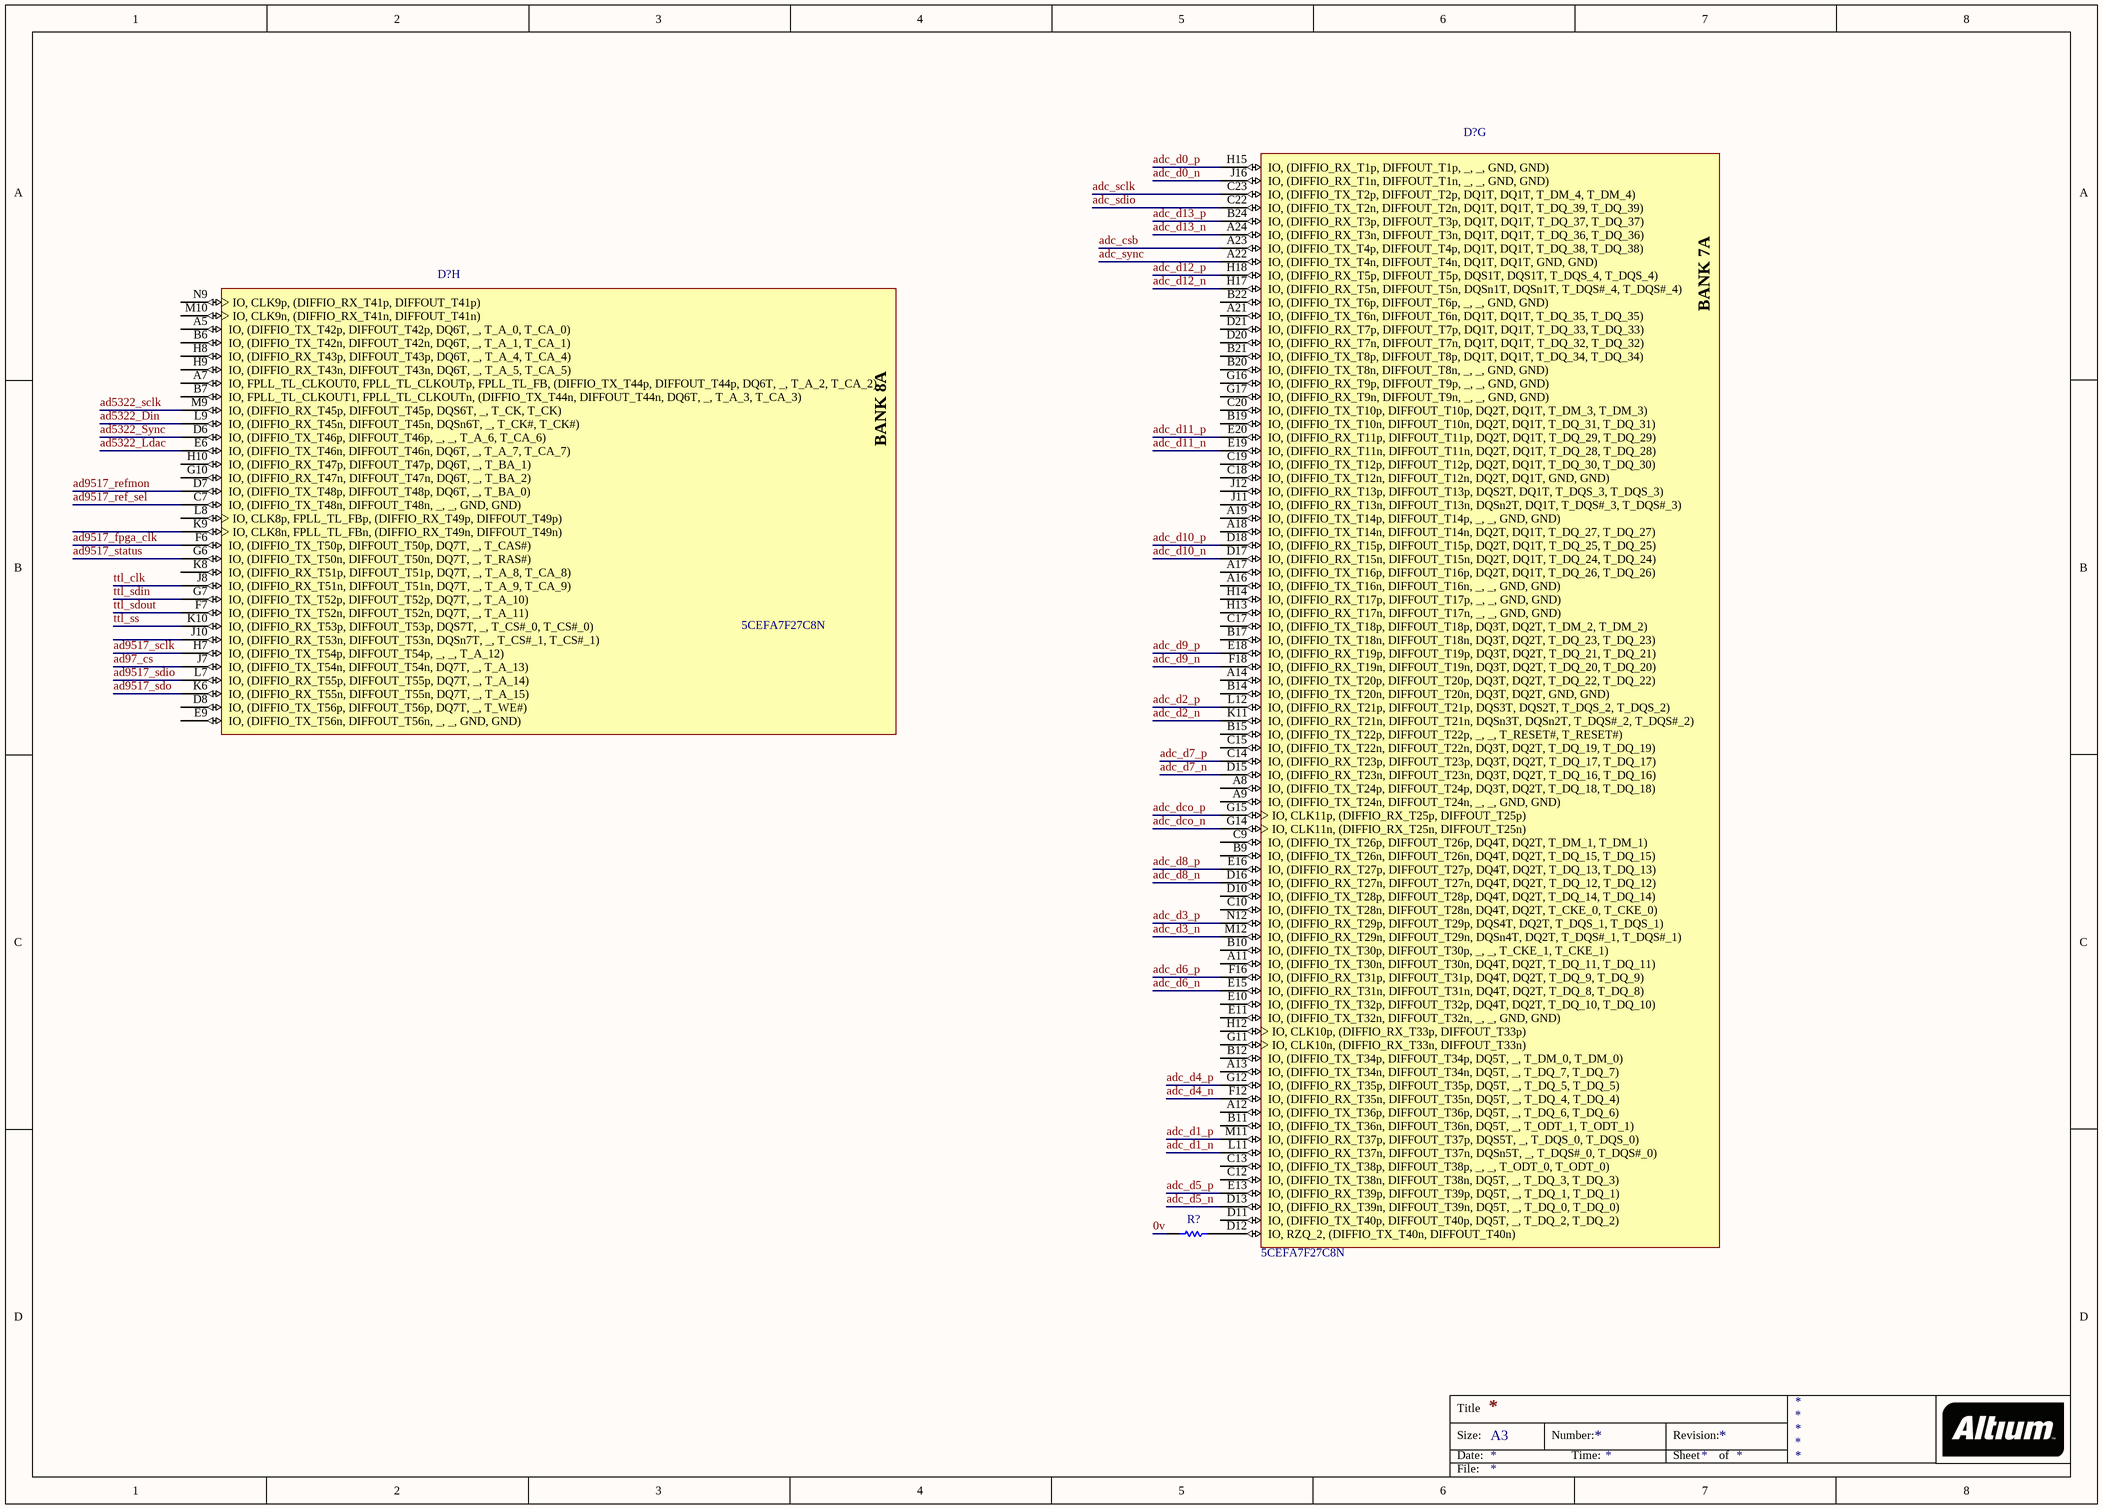
[diagram p6: as14120_fpga_adc.SchDoc]

### Parts
(Parts that share a designator on the sheet are numbered #1, #2 ... from top to bottom, then left to right.)
D?#1  5CEFA7F27C8N  [ALTR-672-FBGA-2000A]  (part G of 12)
D?#2  5CEFA7F27C8N  [ALTR-672-FBGA-2000A]  (part H of 12)
R?  ???  [RESC0603(1608)_L]  (value not drawn)

### Nets
0v: R?.1
ad97_cs: D?#2.J7(IO,_(DIFFIO_TX_T54n,_DIFFOUT_T54n,_DQ7T,__,_T_A_13))
ad5322_Din: D?#2.L9(IO,_(DIFFIO_RX_T45n,_DIFFOUT_T45n,_DQSn6T,__,_T_CK#,_T_CK#))
ad5322_Ldac: D?#2.E6(IO,_(DIFFIO_TX_T46n,_DIFFOUT_T46n,_DQ6T,__,_T_A_7,_T_CA_7))
ad5322_sclk: D?#2.M9(IO,_(DIFFIO_RX_T45p,_DIFFOUT_T45p,_DQS6T,__,_T_CK,_T_CK))
ad5322_Sync: D?#2.D6(IO,_(DIFFIO_TX_T46p,_DIFFOUT_T46p,__,__,_T_A_6,_T_CA_6))
ad9517_fpga_clk: D?#2.F6(IO,_(DIFFIO_TX_T50p,_DIFFOUT_T50p,_DQ7T,__,_T_CAS#))
ad9517_ref_sel: D?#2.C7(IO,_(DIFFIO_TX_T48n,_DIFFOUT_T48n,__,__,_GND,_GND))
ad9517_refmon: D?#2.D7(IO,_(DIFFIO_TX_T48p,_DIFFOUT_T48p,_DQ6T,__,_T_BA_0))
ad9517_sclk: D?#2.H7(IO,_(DIFFIO_TX_T54p,_DIFFOUT_T54p,__,__,_T_A_12))
ad9517_sdio: D?#2.L7(IO,_(DIFFIO_RX_T55p,_DIFFOUT_T55p,_DQ7T,__,_T_A_14))
ad9517_sdo: D?#2.K6(IO,_(DIFFIO_RX_T55n,_DIFFOUT_T55n,_DQ7T,__,_T_A_15))
ad9517_status: D?#2.G6(IO,_(DIFFIO_TX_T50n,_DIFFOUT_T50n,_DQ7T,__,_T_RAS#))
adc_csb: D?#1.A23(IO,_(DIFFIO_TX_T4p,_DIFFOUT_T4p,_DQ1T,_DQ1T,_T_DQ_38,_T_DQ_38))
adc_d0_n: D?#1.J16(IO,_(DIFFIO_RX_T1n,_DIFFOUT_T1n,__,__,_GND,_GND))
adc_d0_p: D?#1.H15(IO,_(DIFFIO_RX_T1p,_DIFFOUT_T1p,__,__,_GND,_GND))
adc_d1_n: D?#1.L11(IO,_(DIFFIO_RX_T37n,_DIFFOUT_T37n,_DQSn5T,__,_T_DQS#_0,_T_DQS#_0))
adc_d1_p: D?#1.M11(IO,_(DIFFIO_RX_T37p,_DIFFOUT_T37p,_DQS5T,__,_T_DQS_0,_T_DQS_0))
adc_d2_n: D?#1.K11(IO,_(DIFFIO_RX_T21n,_DIFFOUT_T21n,_DQSn3T,_DQSn2T,_T_DQS#_2,_T_DQS#_2))
adc_d2_p: D?#1.L12(IO,_(DIFFIO_RX_T21p,_DIFFOUT_T21p,_DQS3T,_DQS2T,_T_DQS_2,_T_DQS_2))
adc_d3_n: D?#1.M12(IO,_(DIFFIO_RX_T29n,_DIFFOUT_T29n,_DQSn4T,_DQ2T,_T_DQS#_1,_T_DQS#_1))
adc_d3_p: D?#1.N12(IO,_(DIFFIO_RX_T29p,_DIFFOUT_T29p,_DQS4T,_DQ2T,_T_DQS_1,_T_DQS_1))
adc_d4_n: D?#1.F12(IO,_(DIFFIO_RX_T35n,_DIFFOUT_T35n,_DQ5T,__,_T_DQ_4,_T_DQ_4))
adc_d4_p: D?#1.G12(IO,_(DIFFIO_RX_T35p,_DIFFOUT_T35p,_DQ5T,__,_T_DQ_5,_T_DQ_5))
adc_d5_n: D?#1.D13(IO,_(DIFFIO_RX_T39n,_DIFFOUT_T39n,_DQ5T,__,_T_DQ_0,_T_DQ_0))
adc_d5_p: D?#1.E13(IO,_(DIFFIO_RX_T39p,_DIFFOUT_T39p,_DQ5T,__,_T_DQ_1,_T_DQ_1))
adc_d6_n: D?#1.E15(IO,_(DIFFIO_RX_T31n,_DIFFOUT_T31n,_DQ4T,_DQ2T,_T_DQ_8,_T_DQ_8))
adc_d6_p: D?#1.F16(IO,_(DIFFIO_RX_T31p,_DIFFOUT_T31p,_DQ4T,_DQ2T,_T_DQ_9,_T_DQ_9))
adc_d7_n: D?#1.D15(IO,_(DIFFIO_RX_T23n,_DIFFOUT_T23n,_DQ3T,_DQ2T,_T_DQ_16,_T_DQ_16))
adc_d7_p: D?#1.C14(IO,_(DIFFIO_RX_T23p,_DIFFOUT_T23p,_DQ3T,_DQ2T,_T_DQ_17,_T_DQ_17))
adc_d8_n: D?#1.D16(IO,_(DIFFIO_RX_T27n,_DIFFOUT_T27n,_DQ4T,_DQ2T,_T_DQ_12,_T_DQ_12))
adc_d8_p: D?#1.E16(IO,_(DIFFIO_RX_T27p,_DIFFOUT_T27p,_DQ4T,_DQ2T,_T_DQ_13,_T_DQ_13))
adc_d9_n: D?#1.F18(IO,_(DIFFIO_RX_T19n,_DIFFOUT_T19n,_DQ3T,_DQ2T,_T_DQ_20,_T_DQ_20))
adc_d9_p: D?#1.E18(IO,_(DIFFIO_RX_T19p,_DIFFOUT_T19p,_DQ3T,_DQ2T,_T_DQ_21,_T_DQ_21))
adc_d10_n: D?#1.D17(IO,_(DIFFIO_RX_T15n,_DIFFOUT_T15n,_DQ2T,_DQ1T,_T_DQ_24,_T_DQ_24))
adc_d10_p: D?#1.D18(IO,_(DIFFIO_RX_T15p,_DIFFOUT_T15p,_DQ2T,_DQ1T,_T_DQ_25,_T_DQ_25))
adc_d11_n: D?#1.E19(IO,_(DIFFIO_RX_T11n,_DIFFOUT_T11n,_DQ2T,_DQ1T,_T_DQ_28,_T_DQ_28))
adc_d11_p: D?#1.E20(IO,_(DIFFIO_RX_T11p,_DIFFOUT_T11p,_DQ2T,_DQ1T,_T_DQ_29,_T_DQ_29))
adc_d12_n: D?#1.H17(IO,_(DIFFIO_RX_T5n,_DIFFOUT_T5n,_DQSn1T,_DQSn1T,_T_DQS#_4,_T_DQS#_4))
adc_d12_p: D?#1.H18(IO,_(DIFFIO_RX_T5p,_DIFFOUT_T5p,_DQS1T,_DQS1T,_T_DQS_4,_T_DQS_4))
adc_d13_n: D?#1.A24(IO,_(DIFFIO_RX_T3n,_DIFFOUT_T3n,_DQ1T,_DQ1T,_T_DQ_36,_T_DQ_36))
adc_d13_p: D?#1.B24(IO,_(DIFFIO_RX_T3p,_DIFFOUT_T3p,_DQ1T,_DQ1T,_T_DQ_37,_T_DQ_37))
adc_dco_n: D?#1.G14(IO,_CLK11n,_(DIFFIO_RX_T25n,_DIFFOUT_T25n))
adc_dco_p: D?#1.G15(IO,_CLK11p,_(DIFFIO_RX_T25p,_DIFFOUT_T25p))
adc_sclk: D?#1.C23(IO,_(DIFFIO_TX_T2p,_DIFFOUT_T2p,_DQ1T,_DQ1T,_T_DM_4,_T_DM_4))
adc_sdio: D?#1.C22(IO,_(DIFFIO_TX_T2n,_DIFFOUT_T2n,_DQ1T,_DQ1T,_T_DQ_39,_T_DQ_39))
adc_sync: D?#1.A22(IO,_(DIFFIO_TX_T4n,_DIFFOUT_T4n,_DQ1T,_DQ1T,_GND,_GND))
ttl_clk: D?#2.J8(IO,_(DIFFIO_RX_T51n,_DIFFOUT_T51n,_DQ7T,__,_T_A_9,_T_CA_9))
ttl_sdin: D?#2.G7(IO,_(DIFFIO_TX_T52p,_DIFFOUT_T52p,_DQ7T,__,_T_A_10))
ttl_sdout: D?#2.F7(IO,_(DIFFIO_TX_T52n,_DIFFOUT_T52n,_DQ7T,__,_T_A_11))
ttl_ss: D?#2.K10(IO,_(DIFFIO_RX_T53p,_DIFFOUT_T53p,_DQS7T,__,_T_CS#_0,_T_CS#_0))
NetD?#1_D12: D?#1.D12(IO,_RZQ_2,_(DIFFIO_TX_T40n,_DIFFOUT_T40n)) R?.2

Not connected (* = marked no-connect by the designer): D?#1 A8(IO,_(DIFFIO_TX_T24p,_DIFFOUT_T24p,_DQ3T,_DQ2T,_T_DQ_18,_T_DQ_18)) A9(IO,_(DIFFIO_TX_T24n,_DIFFOUT_T24n,__,__,_GND,_GND)) A11(IO,_(DIFFIO_TX_T30n,_DIFFOUT_T30n,_DQ4T,_DQ2T,_T_DQ_11,_T_DQ_11)) A12(IO,_(DIFFIO_TX_T36p,_DIFFOUT_T36p,_DQ5T,__,_T_DQ_6,_T_DQ_6)) A13(IO,_(DIFFIO_TX_T34n,_DIFFOUT_T34n,_DQ5T,__,_T_DQ_7,_T_DQ_7)) A14(IO,_(DIFFIO_TX_T20p,_DIFFOUT_T20p,_DQ3T,_DQ2T,_T_DQ_22,_T_DQ_22)) A16(IO,_(DIFFIO_TX_T16n,_DIFFOUT_T16n,__,__,_GND,_GND)) A17(IO,_(DIFFIO_TX_T16p,_DIFFOUT_T16p,_DQ2T,_DQ1T,_T_DQ_26,_T_DQ_26)) A18(IO,_(DIFFIO_TX_T14n,_DIFFOUT_T14n,_DQ2T,_DQ1T,_T_DQ_27,_T_DQ_27)) A19(IO,_(DIFFIO_TX_T14p,_DIFFOUT_T14p,__,__,_GND,_GND)) A21(IO,_(DIFFIO_TX_T6n,_DIFFOUT_T6n,_DQ1T,_DQ1T,_T_DQ_35,_T_DQ_35)) B9(IO,_(DIFFIO_TX_T26n,_DIFFOUT_T26n,_DQ4T,_DQ2T,_T_DQ_15,_T_DQ_15)) B10(IO,_(DIFFIO_TX_T30p,_DIFFOUT_T30p,__,__,_T_CKE_1,_T_CKE_1)) B11(IO,_(DIFFIO_TX_T36n,_DIFFOUT_T36n,_DQ5T,__,_T_ODT_1,_T_ODT_1)) B12(IO,_(DIFFIO_TX_T34p,_DIFFOUT_T34p,_DQ5T,__,_T_DM_0,_T_DM_0)) B14(IO,_(DIFFIO_TX_T20n,_DIFFOUT_T20n,_DQ3T,_DQ2T,_GND,_GND)) B15(IO,_(DIFFIO_TX_T22p,_DIFFOUT_T22p,__,__,_T_RESET#,_T_RESET#)) B17(IO,_(DIFFIO_TX_T18n,_DIFFOUT_T18n,_DQ3T,_DQ2T,_T_DQ_23,_T_DQ_23)) B19(IO,_(DIFFIO_TX_T10n,_DIFFOUT_T10n,_DQ2T,_DQ1T,_T_DQ_31,_T_DQ_31)) B20(IO,_(DIFFIO_TX_T8n,_DIFFOUT_T8n,__,__,_GND,_GND)) B21(IO,_(DIFFIO_TX_T8p,_DIFFOUT_T8p,_DQ1T,_DQ1T,_T_DQ_34,_T_DQ_34)) B22(IO,_(DIFFIO_TX_T6p,_DIFFOUT_T6p,__,__,_GND,_GND)) C9(IO,_(DIFFIO_TX_T26p,_DIFFOUT_T26p,_DQ4T,_DQ2T,_T_DM_1,_T_DM_1)) C10(IO,_(DIFFIO_TX_T28n,_DIFFOUT_T28n,_DQ4T,_DQ2T,_T_CKE_0,_T_CKE_0)) C12(IO,_(DIFFIO_TX_T38n,_DIFFOUT_T38n,_DQ5T,__,_T_DQ_3,_T_DQ_3)) C13(IO,_(DIFFIO_TX_T38p,_DIFFOUT_T38p,__,__,_T_ODT_0,_T_ODT_0)) C15(IO,_(DIFFIO_TX_T22n,_DIFFOUT_T22n,_DQ3T,_DQ2T,_T_DQ_19,_T_DQ_19)) C17(IO,_(DIFFIO_TX_T18p,_DIFFOUT_T18p,_DQ3T,_DQ2T,_T_DM_2,_T_DM_2)) C18(IO,_(DIFFIO_TX_T12n,_DIFFOUT_T12n,_DQ2T,_DQ1T,_GND,_GND)) C19(IO,_(DIFFIO_TX_T12p,_DIFFOUT_T12p,_DQ2T,_DQ1T,_T_DQ_30,_T_DQ_30)) C20(IO,_(DIFFIO_TX_T10p,_DIFFOUT_T10p,_DQ2T,_DQ1T,_T_DM_3,_T_DM_3)) D10(IO,_(DIFFIO_TX_T28p,_DIFFOUT_T28p,_DQ4T,_DQ2T,_T_DQ_14,_T_DQ_14)) D11(IO,_(DIFFIO_TX_T40p,_DIFFOUT_T40p,_DQ5T,__,_T_DQ_2,_T_DQ_2)) D20(IO,_(DIFFIO_RX_T7n,_DIFFOUT_T7n,_DQ1T,_DQ1T,_T_DQ_32,_T_DQ_32)) D21(IO,_(DIFFIO_RX_T7p,_DIFFOUT_T7p,_DQ1T,_DQ1T,_T_DQ_33,_T_DQ_33)) E10(IO,_(DIFFIO_TX_T32p,_DIFFOUT_T32p,_DQ4T,_DQ2T,_T_DQ_10,_T_DQ_10)) E11(IO,_(DIFFIO_TX_T32n,_DIFFOUT_T32n,__,__,_GND,_GND)) G11(IO,_CLK10n,_(DIFFIO_RX_T33n,_DIFFOUT_T33n)) G16(IO,_(DIFFIO_RX_T9p,_DIFFOUT_T9p,__,__,_GND,_GND)) G17(IO,_(DIFFIO_RX_T9n,_DIFFOUT_T9n,__,__,_GND,_GND)) H12(IO,_CLK10p,_(DIFFIO_RX_T33p,_DIFFOUT_T33p)) H13(IO,_(DIFFIO_RX_T17n,_DIFFOUT_T17n,__,__,_GND,_GND)) H14(IO,_(DIFFIO_RX_T17p,_DIFFOUT_T17p,__,__,_GND,_GND)) J11(IO,_(DIFFIO_RX_T13n,_DIFFOUT_T13n,_DQSn2T,_DQ1T,_T_DQS#_3,_T_DQS#_3)) J12(IO,_(DIFFIO_RX_T13p,_DIFFOUT_T13p,_DQS2T,_DQ1T,_T_DQS_3,_T_DQS_3)); D?#2 A5(IO,_(DIFFIO_TX_T42p,_DIFFOUT_T42p,_DQ6T,__,_T_A_0,_T_CA_0)) A7(IO,_FPLL_TL_CLKOUT0,_FPLL_TL_CLKOUTp,_FPLL_TL_FB,_(DIFFIO_TX_T44p,_DIFFOUT_T44p,_DQ6T,__,_T_A_2,_T_CA_2)) B6(IO,_(DIFFIO_TX_T42n,_DIFFOUT_T42n,_DQ6T,__,_T_A_1,_T_CA_1)) B7(IO,_FPLL_TL_CLKOUT1,_FPLL_TL_CLKOUTn,_(DIFFIO_TX_T44n,_DIFFOUT_T44n,_DQ6T,__,_T_A_3,_T_CA_3)) D8(IO,_(DIFFIO_TX_T56p,_DIFFOUT_T56p,_DQ7T,__,_T_WE#)) E9(IO,_(DIFFIO_TX_T56n,_DIFFOUT_T56n,__,__,_GND,_GND)) G10(IO,_(DIFFIO_RX_T47n,_DIFFOUT_T47n,_DQ6T,__,_T_BA_2)) H8(IO,_(DIFFIO_RX_T43p,_DIFFOUT_T43p,_DQ6T,__,_T_A_4,_T_CA_4)) H9(IO,_(DIFFIO_RX_T43n,_DIFFOUT_T43n,_DQ6T,__,_T_A_5,_T_CA_5)) H10(IO,_(DIFFIO_RX_T47p,_DIFFOUT_T47p,_DQ6T,__,_T_BA_1)) J10(IO,_(DIFFIO_RX_T53n,_DIFFOUT_T53n,_DQSn7T,__,_T_CS#_1,_T_CS#_1)) K8(IO,_(DIFFIO_RX_T51p,_DIFFOUT_T51p,_DQ7T,__,_T_A_8,_T_CA_8)) K9(IO,_CLK8n,_FPLL_TL_FBn,_(DIFFIO_RX_T49n,_DIFFOUT_T49n)) L8(IO,_CLK8p,_FPLL_TL_FBp,_(DIFFIO_RX_T49p,_DIFFOUT_T49p)) M10(IO,_CLK9n,_(DIFFIO_RX_T41n,_DIFFOUT_T41n)) N9(IO,_CLK9p,_(DIFFIO_RX_T41p,_DIFFOUT_T41p))

### Notes on the sheet
- Title
- Size:
- Date:
- A3
- Number:
- Time:
- Revision:
- Sheet
- of
- File:
- (in symbol 5CEFA7F27C8N, part G) BANK 7A
- (in symbol 5CEFA7F27C8N, part H) BANK 8A

### Library data of the parts
D?#1 D?#2 = 5CEFA7F27C8N: as D5 on sheet as14120_fpga_cypress; DatasheetVersion: Rev. 3.1; PackageReference: 672-FBGA-2000A; PackageDescription: 672-Pin FineLine Ball-Grid Array (FBGA), Body 27 x 27 mm, Pitch 1 mm; Supplier 1: Digi-Key; Supplier Part Number 1: 5CEFA7F27C8N-ND; Supplier 2: Mouser; Supplier Part Number 2: 989-5CEFA7F27C8N; RoHS: RoHS Compliant; Subcategory: Cyclone V E; Voltage Supply: 1.07 to 1.13 V; Mounting Technology: Surface Mount; Code_JEDEC: MS-034-AAL-1; PartNumber: 5CEFA7F27C8N; ComponentLink1Description: Manufacturer URL; ComponentLink1URL: http://www.altera.com; ComponentLink2Description: Datasheet; ComponentLink2URL: http://www.altera.com/literature/hb/cyclone-v/cv_51002.pdf; ComponentLink3Description: Package Specification; ComponentLink3URL: http://www.altera.com/devicepackaging/04R00427-01.pdf; ComponentLink4Description: Device Handbook URL; ComponentLink4URL: http://www.altera.com/literature/hb/cyclone-v/cyclone5_handbook.pdf; ComponentLink5Description: Device Overview URL; ComponentLink5URL: http://www.altera.com/literature/hb/cyclone-v/cv_51001.pdf; ComponentLink6Description: Device Pin-Out URL; ComponentLink6URL: http://www.altera.com/literature/dp/cyclone-v/1.1.txt; ComponentLink7Description: Product URL; ComponentLink7URL: http://www.buyaltera.com/scripts/partsearch.dll?Detail&name=5CEFA7F27C8N-ND
R? = RES_0603: as R102 on sheet as14120_fpga_cypress; Technology: SMT; Value: ???; Tolerance: 5 %; Power: 0.1 W

## Nets that join several sheets
0v: as14120_usb (69 pins), as14120_ddr (102 pins), as14120_fpga_ttl (10 pins), as14120_fpga_ddr (18 pins), as14120_fpga_power_conf (261 pins), as14120_fpga_cypress (5 pins), as14120_fpga_adc (R?.1)
ddr_a0: as14120_ddr (D8.N3 D9.N3 R58.6), as14120_fpga_ddr (D5.AE6)
ddr_a1: as14120_ddr (D8.P7 D9.P7 R56.5), as14120_fpga_ddr (D5.AF6)
ddr_a2: as14120_ddr (D8.P3 D9.P3 R59.5), as14120_fpga_ddr (D5.AF7)
ddr_a3: as14120_ddr (D8.N2 D9.N2 R58.5), as14120_fpga_ddr (D5.AF8)
ddr_a4: as14120_ddr (D8.P8 D9.P8 R56.6), as14120_fpga_ddr (D5.U10)
ddr_a5: as14120_ddr (D8.P2 D9.P2 R58.8), as14120_fpga_ddr (D5.U11)
ddr_a6: as14120_ddr (D8.R8 D9.R8 R57.7), as14120_fpga_ddr (D5.AE9)
ddr_a7: as14120_ddr (D8.R2 D9.R2 R59.6), as14120_fpga_ddr (D5.AF9)
ddr_a8: as14120_ddr (D8.T8 D9.T8 R57.8), as14120_fpga_ddr (D5.AB12)
ddr_a9: as14120_ddr (D8.R3 D9.R3 R59.7), as14120_fpga_ddr (D5.AB11)
ddr_a10: as14120_ddr (D8.L7 D9.L7), as14120_fpga_ddr (D5.AC9)
ddr_a11: as14120_ddr (D8.R7 D9.R7 R57.5), as14120_fpga_ddr (D5.AC8)
ddr_a12: as14120_ddr (D8.N7 D9.N7 R56.7), as14120_fpga_ddr (D5.AB10)
ddr_a13: as14120_ddr (D8.T3 D9.T3 R59.8), as14120_fpga_ddr (D5.AC10)
ddr_a14: as14120_ddr (D8.T7 D9.T7 R57.6), as14120_fpga_ddr (D5.W11)
ddr_ba0: as14120_ddr (D8.M2 D9.M2), as14120_fpga_ddr (D5.V10)
ddr_ba1: as14120_ddr (D8.N8 D9.N8), as14120_fpga_ddr (D5.AD8)
ddr_ba2: as14120_ddr (D8.M3 D9.M3 R58.7), as14120_fpga_ddr (D5.AE8)
ddr_cas: as14120_ddr (D8.K3 D9.K3), as14120_fpga_ddr (D5.W10)
ddr_ck_n: as14120_ddr (D8.K7 D9.K7 R63.1), as14120_fpga_ddr (D5.P10)
ddr_ck_p: as14120_ddr (D8.J7 D9.J7 R64.2), as14120_fpga_ddr (D5.N10)
ddr_cke: as14120_ddr (D8.K9 D9.K9 R65.2), as14120_fpga_ddr (D5.AF14)
ddr_cs: as14120_ddr (D8.L2 D9.L2), as14120_fpga_ddr (D5.R11)
ddr_dm0: as14120_ddr (D8.E7), as14120_fpga_ddr (D5.AF11)
ddr_dm1: as14120_ddr (D8.D3), as14120_fpga_ddr (D5.AE18)
ddr_dm2: as14120_ddr (D9.E7), as14120_fpga_ddr (D5.AE20)
ddr_dm3: as14120_ddr (D9.D3), as14120_fpga_ddr (D5.AE24)
ddr_dq0: as14120_ddr (D8.E3), as14120_fpga_ddr (D5.AA14)
ddr_dq1: as14120_ddr (D8.F7), as14120_fpga_ddr (D5.Y14)
ddr_dq2: as14120_ddr (D8.F2), as14120_fpga_ddr (D5.AD11)
ddr_dq3: as14120_ddr (D8.F8), as14120_fpga_ddr (D5.AD12)
ddr_dq4: as14120_ddr (D8.H3), as14120_fpga_ddr (D5.Y13)
ddr_dq5: as14120_ddr (D8.H8), as14120_fpga_ddr (D5.W12)
ddr_dq6: as14120_ddr (D8.G2), as14120_fpga_ddr (D5.AD10)
ddr_dq7: as14120_ddr (D8.H7), as14120_fpga_ddr (D5.AF12)
ddr_dq8: as14120_ddr (D8.D7), as14120_fpga_ddr (D5.AC15)
ddr_dq9: as14120_ddr (D8.C3), as14120_fpga_ddr (D5.AB15)
ddr_dq10: as14120_ddr (D8.C8), as14120_fpga_ddr (D5.AC14)
ddr_dq11: as14120_ddr (D8.C2), as14120_fpga_ddr (D5.AF13)
ddr_dq12: as14120_ddr (D8.A7), as14120_fpga_ddr (D5.AB16)
ddr_dq13: as14120_ddr (D8.A2), as14120_fpga_ddr (D5.AA16)
ddr_dq14: as14120_ddr (D8.B8), as14120_fpga_ddr (D5.AE14)
ddr_dq15: as14120_ddr (D8.A3), as14120_fpga_ddr (D5.AF18)
ddr_dq16: as14120_ddr (D9.E3), as14120_fpga_ddr (D5.AD16)
ddr_dq17: as14120_ddr (D9.F7), as14120_fpga_ddr (D5.AD17)
ddr_dq18: as14120_ddr (D9.F2), as14120_fpga_ddr (D5.AC18)
ddr_dq19: as14120_ddr (D9.F8), as14120_fpga_ddr (D5.AF19)
ddr_dq20: as14120_ddr (D9.H3), as14120_fpga_ddr (D5.AC17)
ddr_dq21: as14120_ddr (D9.H8), as14120_fpga_ddr (D5.AB17)
ddr_dq22: as14120_ddr (D9.G2), as14120_fpga_ddr (D5.AF21)
ddr_dq23: as14120_ddr (D9.H7), as14120_fpga_ddr (D5.AE21)
ddr_dq24: as14120_ddr (D9.D7), as14120_fpga_ddr (D5.AE15)
ddr_dq25: as14120_ddr (D9.C3), as14120_fpga_ddr (D5.AE16)
ddr_dq26: as14120_ddr (D9.C8), as14120_fpga_ddr (D5.AC20)
ddr_dq27: as14120_ddr (D9.C2), as14120_fpga_ddr (D5.AD21)
ddr_dq28: as14120_ddr (D9.A7), as14120_fpga_ddr (D5.AF16)
ddr_dq29: as14120_ddr (D9.A2), as14120_fpga_ddr (D5.AF17)
ddr_dq30: as14120_ddr (D9.B8), as14120_fpga_ddr (D5.AD23)
ddr_dq31: as14120_ddr (D9.A3), as14120_fpga_ddr (D5.AF23)
ddr_dqs0_n: as14120_ddr (D8.G3), as14120_fpga_ddr (D5.W13)
ddr_dqs0_p: as14120_ddr (D8.F3), as14120_fpga_ddr (D5.V13)
ddr_dqs1_n: as14120_ddr (D8.B7), as14120_fpga_ddr (D5.V14)
ddr_dqs1_p: as14120_ddr (D8.C7), as14120_fpga_ddr (D5.U14)
ddr_dqs2_n: as14120_ddr (D9.G3), as14120_fpga_ddr (D5.W15)
ddr_dqs2_p: as14120_ddr (D9.F3), as14120_fpga_ddr (D5.V15)
ddr_dqs3_n: as14120_ddr (D9.B7), as14120_fpga_ddr (D5.W17)
ddr_dqs3_p: as14120_ddr (D9.C7), as14120_fpga_ddr (D5.W16)
ddr_odt: as14120_ddr (D8.K1 D9.K1), as14120_fpga_ddr (D5.AD13)
ddr_ras: as14120_ddr (D8.J3 D9.J3), as14120_fpga_ddr (D5.Y10)
ddr_reset_n: as14120_ddr (D8.T2 D9.T2 R66.2), as14120_fpga_ddr (D5.AE19)
ddr_we: as14120_ddr (D8.L3 D9.L3), as14120_fpga_ddr (D5.T9)
Fpga_CONF_DONE: as14120_usb (D1.D3), as14120_fpga_power_conf (D5.A6 R82.2)
Fpga_Data0: as14120_usb (D1.D5), as14120_fpga_power_conf (D5.AF5)
Fpga_DCLK: as14120_usb (D1.D4), as14120_fpga_power_conf (D5.N8 R83.2)
Fpga_nCONFIG: as14120_usb (D1.C1), as14120_fpga_power_conf (D5.F5 R81.2)
Fpga_nSTATUS: as14120_usb (D1.D2), as14120_fpga_power_conf (D5.B5)
v1p5d: as14120_ddr (76 pins), as14120_fpga_power_conf (22 pins)
v1p8d: as14120_usb (22 pins), as14120_fpga_power_conf (23 pins)
v3p3d: as14120_usb (15 pins), as14120_fpga_ttl (D11.8 R69.2 X6.5 X6.7), as14120_fpga_power_conf (8 pins)
vRefDDR: as14120_ddr (9 pins), as14120_fpga_power_conf (C171.2 C172.2 D5.AC12 D5.AD15)